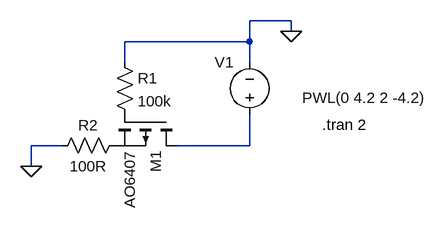
[diagram p0: schematic reverse polarity.asc]
reverse polarity.asc, the LTspice schematic file:
Version 4.1
SHEET 1 880 680
WIRE 432 -16 368 -16
WIRE 432 0 432 -16
WIRE 368 16 368 -16
WIRE 368 16 176 16
WIRE 176 48 176 16
WIRE 368 48 368 16
WIRE 80 176 32 176
WIRE 368 176 368 128
WIRE 368 176 256 176
WIRE 32 208 32 176
FLAG 32 208 0
FLAG 432 0 0
SYMBOL pmos 256 128 R90
SYMATTR InstName M1
SYMATTR Value AO6407
SYMBOL voltage 368 144 R180
WINDOW 0 24 96 Left 2
WINDOW 3 -272 42 Left 2
WINDOW 123 0 0 Left 0
WINDOW 39 0 0 Left 0
SYMATTR InstName V1
SYMATTR Value PWL(0 4.2 2 -4.2)
SYMBOL res 160 32 R0
SYMATTR InstName R1
SYMATTR Value 100k
SYMBOL res 176 160 R90
WINDOW 0 0 56 VBottom 2
WINDOW 3 32 56 VTop 2
SYMATTR InstName R2
SYMATTR Value 100R
TEXT 480 144 Left 2 !.tran 2

The netlist it stands for:
* reverse polarity.asc
M1 N001 P001 P002 P002 AO6407
V1 N001 0 PWL(0 4.2 2 -4.2)
R1 0 P001 100k
R2 P002 0 100R
.model NMOS NMOS
.model PMOS PMOS
.lib standard.mos
.tran 2
.backanno
.end